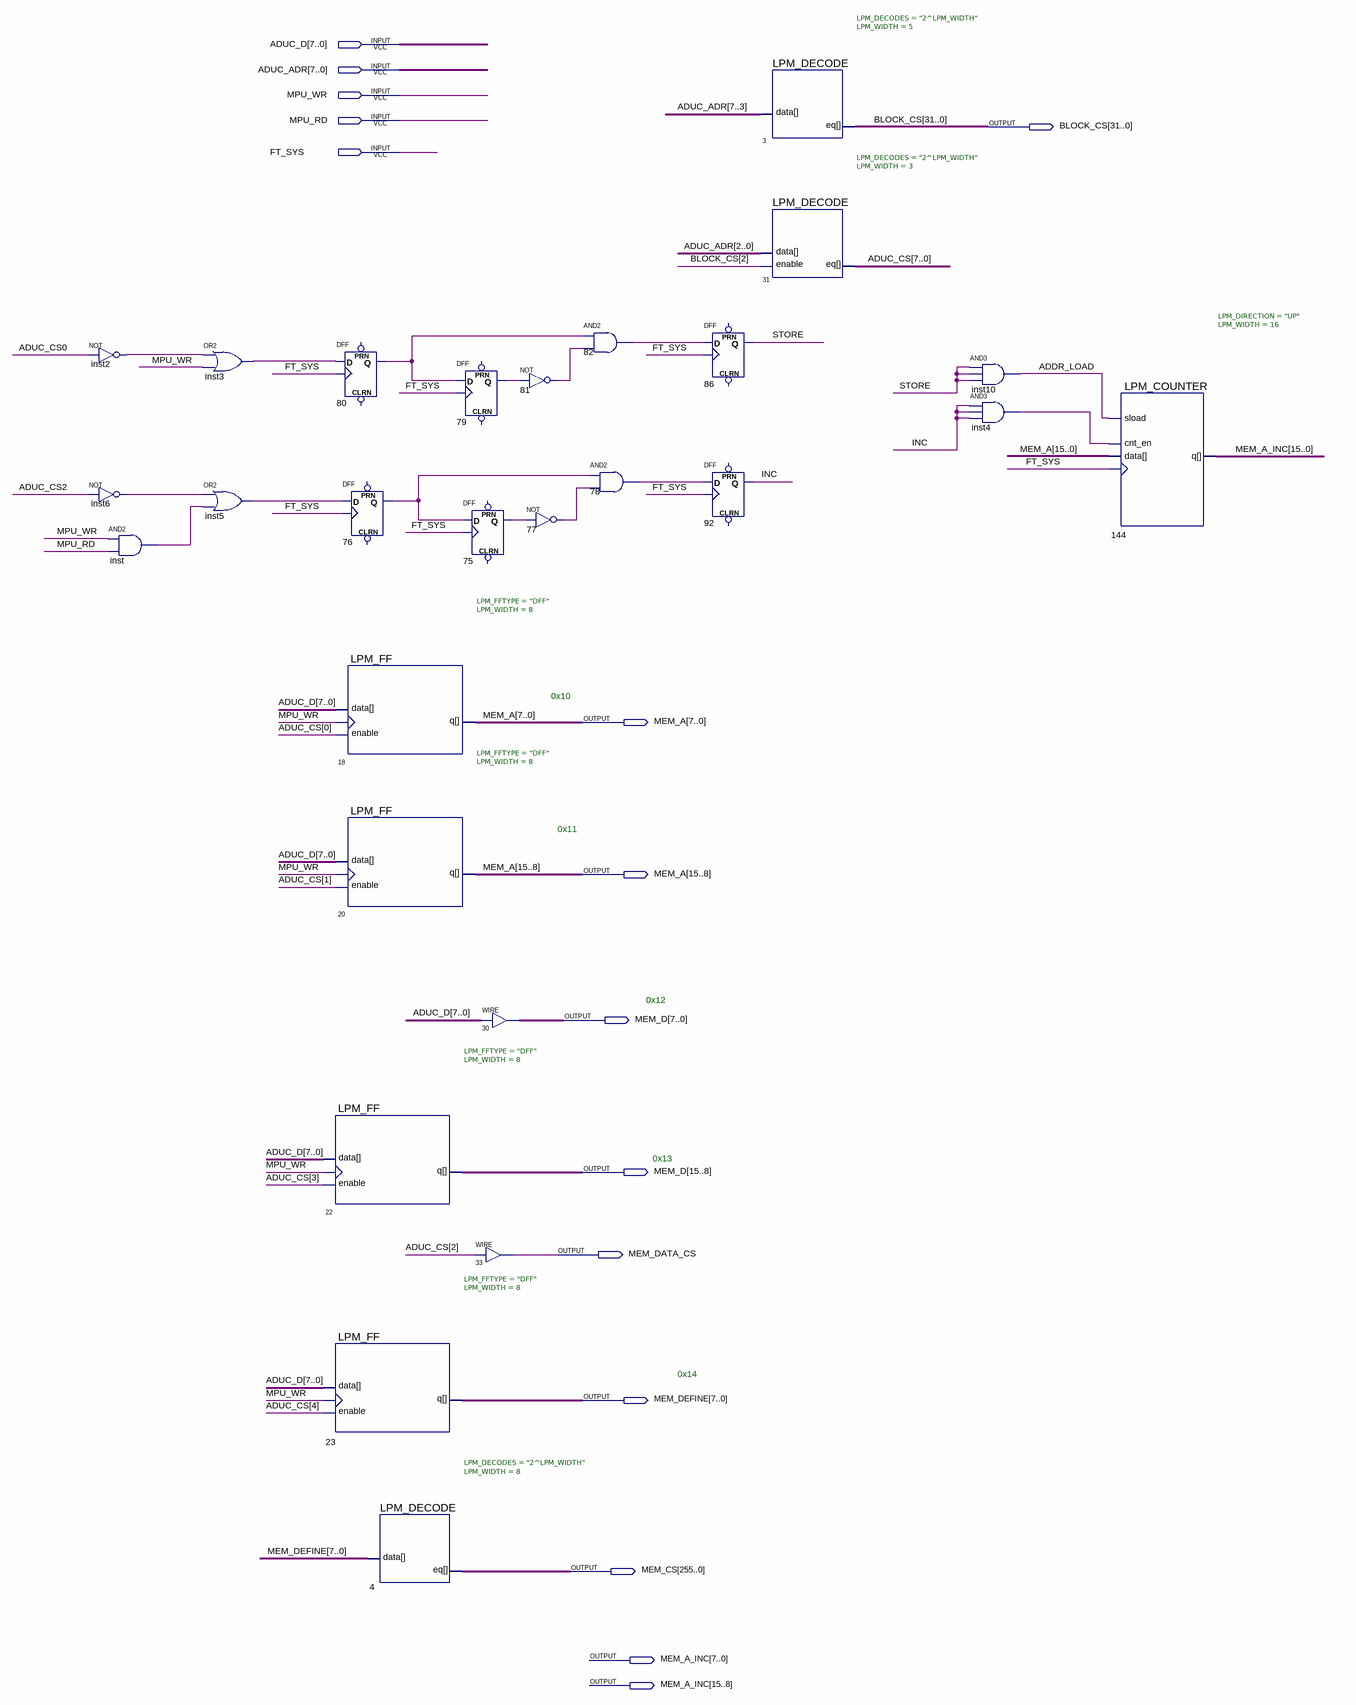
[diagram p0: schematic sheet]
// Quartus schematic port_aduc_afalina.bdf as structural Verilog: 27 symbols, 15 pins
module port_aduc_afalina (
  input  [7:0] ADUC_D,
  input  [7:0] ADUC_ADR,
  input  MPU_WR,
  input  MPU_RD,
  input  FT_SYS,
  output [31:0] BLOCK_CS,
  output [15:0] MEM_A,
  output [15:0] MEM_D,
  output MEM_DATA_CS,
  output [7:0] MEM_DEFINE,
  output [255:0] MEM_CS,
  output [15:0] MEM_A_INC
);

  wire ADDR_LOAD, INC, inst2_out, inst3_out, inst4_out, inst5_out, inst6_out, inst_out, n75_q, n76_q,
       n77_out, n78_out, n79_q, n80_q, n81_out, n82_out, STORE;
  wire [7:0] ADUC_CS;

  not inst2 (inst2_out, ADUC_CS[0]);
  not inst6 (inst6_out, ADUC_CS[2]);
  and inst (inst_out, MPU_WR, MPU_RD);
  or inst3 (inst3_out, inst2_out, MPU_WR);
  or inst5 (inst5_out, inst6_out, inst_out);
  LPM_FF #(.LPM_FFTYPE("DFF"), .LPM_WIDTH(8)) u_22 (
    .enable(ADUC_CS[3]), .clock(MPU_WR), .data(ADUC_D), .q(MEM_D[15:8]));
  LPM_FF #(.LPM_FFTYPE("DFF"), .LPM_WIDTH(8)) u_23 (.enable(ADUC_CS[4]), .clock(MPU_WR), .data(ADUC_D), .q(MEM_DEFINE));
  DFF u_80 (.CLK(FT_SYS), .D(inst3_out), .Q(n80_q));  // open: CLRN, PRN
  DFF u_76 (.CLK(FT_SYS), .D(inst5_out), .Q(n76_q));  // open: CLRN, PRN
  LPM_FF #(.LPM_FFTYPE("DFF"), .LPM_WIDTH(8)) u_18 (.enable(ADUC_CS[0]), .clock(MPU_WR), .data(ADUC_D), .q(MEM_A[7:0]));
  LPM_FF #(.LPM_FFTYPE("DFF"), .LPM_WIDTH(8)) u_20 (
    .enable(ADUC_CS[1]), .clock(MPU_WR), .data(ADUC_D), .q(MEM_A[15:8]));
  LPM_DECODE #(.LPM_DECODES("2^LPM_WIDTH"), .LPM_WIDTH(8)) u_4 (.data(MEM_DEFINE), .eq(MEM_CS));
  DFF u_79 (.CLK(FT_SYS), .D(n80_q), .Q(n79_q));  // open: CLRN, PRN
  DFF u_75 (.CLK(FT_SYS), .D(n76_q), .Q(n75_q));  // open: CLRN, PRN
  assign MEM_DATA_CS = ADUC_CS[2];  // WIRE 33
  not u_81 (n81_out, n79_q);
  not u_77 (n77_out, n75_q);
  assign MEM_D[7:0] = ADUC_D;  // WIRE 30
  and u_82 (n82_out, n80_q, n81_out);
  and u_78 (n78_out, n76_q, n77_out);
  DFF u_86 (.CLK(FT_SYS), .D(n82_out), .Q(STORE));  // open: CLRN, PRN
  DFF u_92 (.CLK(FT_SYS), .D(n78_out), .Q(INC));  // open: CLRN, PRN
  LPM_DECODE #(.LPM_DECODES("2^LPM_WIDTH"), .LPM_WIDTH(5)) u_3 (.data(ADUC_ADR[7:3]), .eq(BLOCK_CS));
  LPM_DECODE #(.LPM_DECODES("2^LPM_WIDTH"), .LPM_WIDTH(3)) u_31 (
    .enable(BLOCK_CS[2]), .data(ADUC_ADR[2:0]), .eq(ADUC_CS));
  and inst10 (ADDR_LOAD, STORE, STORE, STORE);
  and inst4 (inst4_out, INC, INC, INC);
  LPM_COUNTER #(.LPM_DIRECTION("UP"), .LPM_WIDTH(16)) u_144 (
    .sload(ADDR_LOAD), .cnt_en(inst4_out), .data(MEM_A), .clock(FT_SYS), .q(MEM_A_INC));

  // Notes on the sheet:
  //   0x10
  //   0x11
  //   0x12
  //   0x13
  //   0x14
endmodule
